# EAGLE design water system (EAGLE 9.7.0)
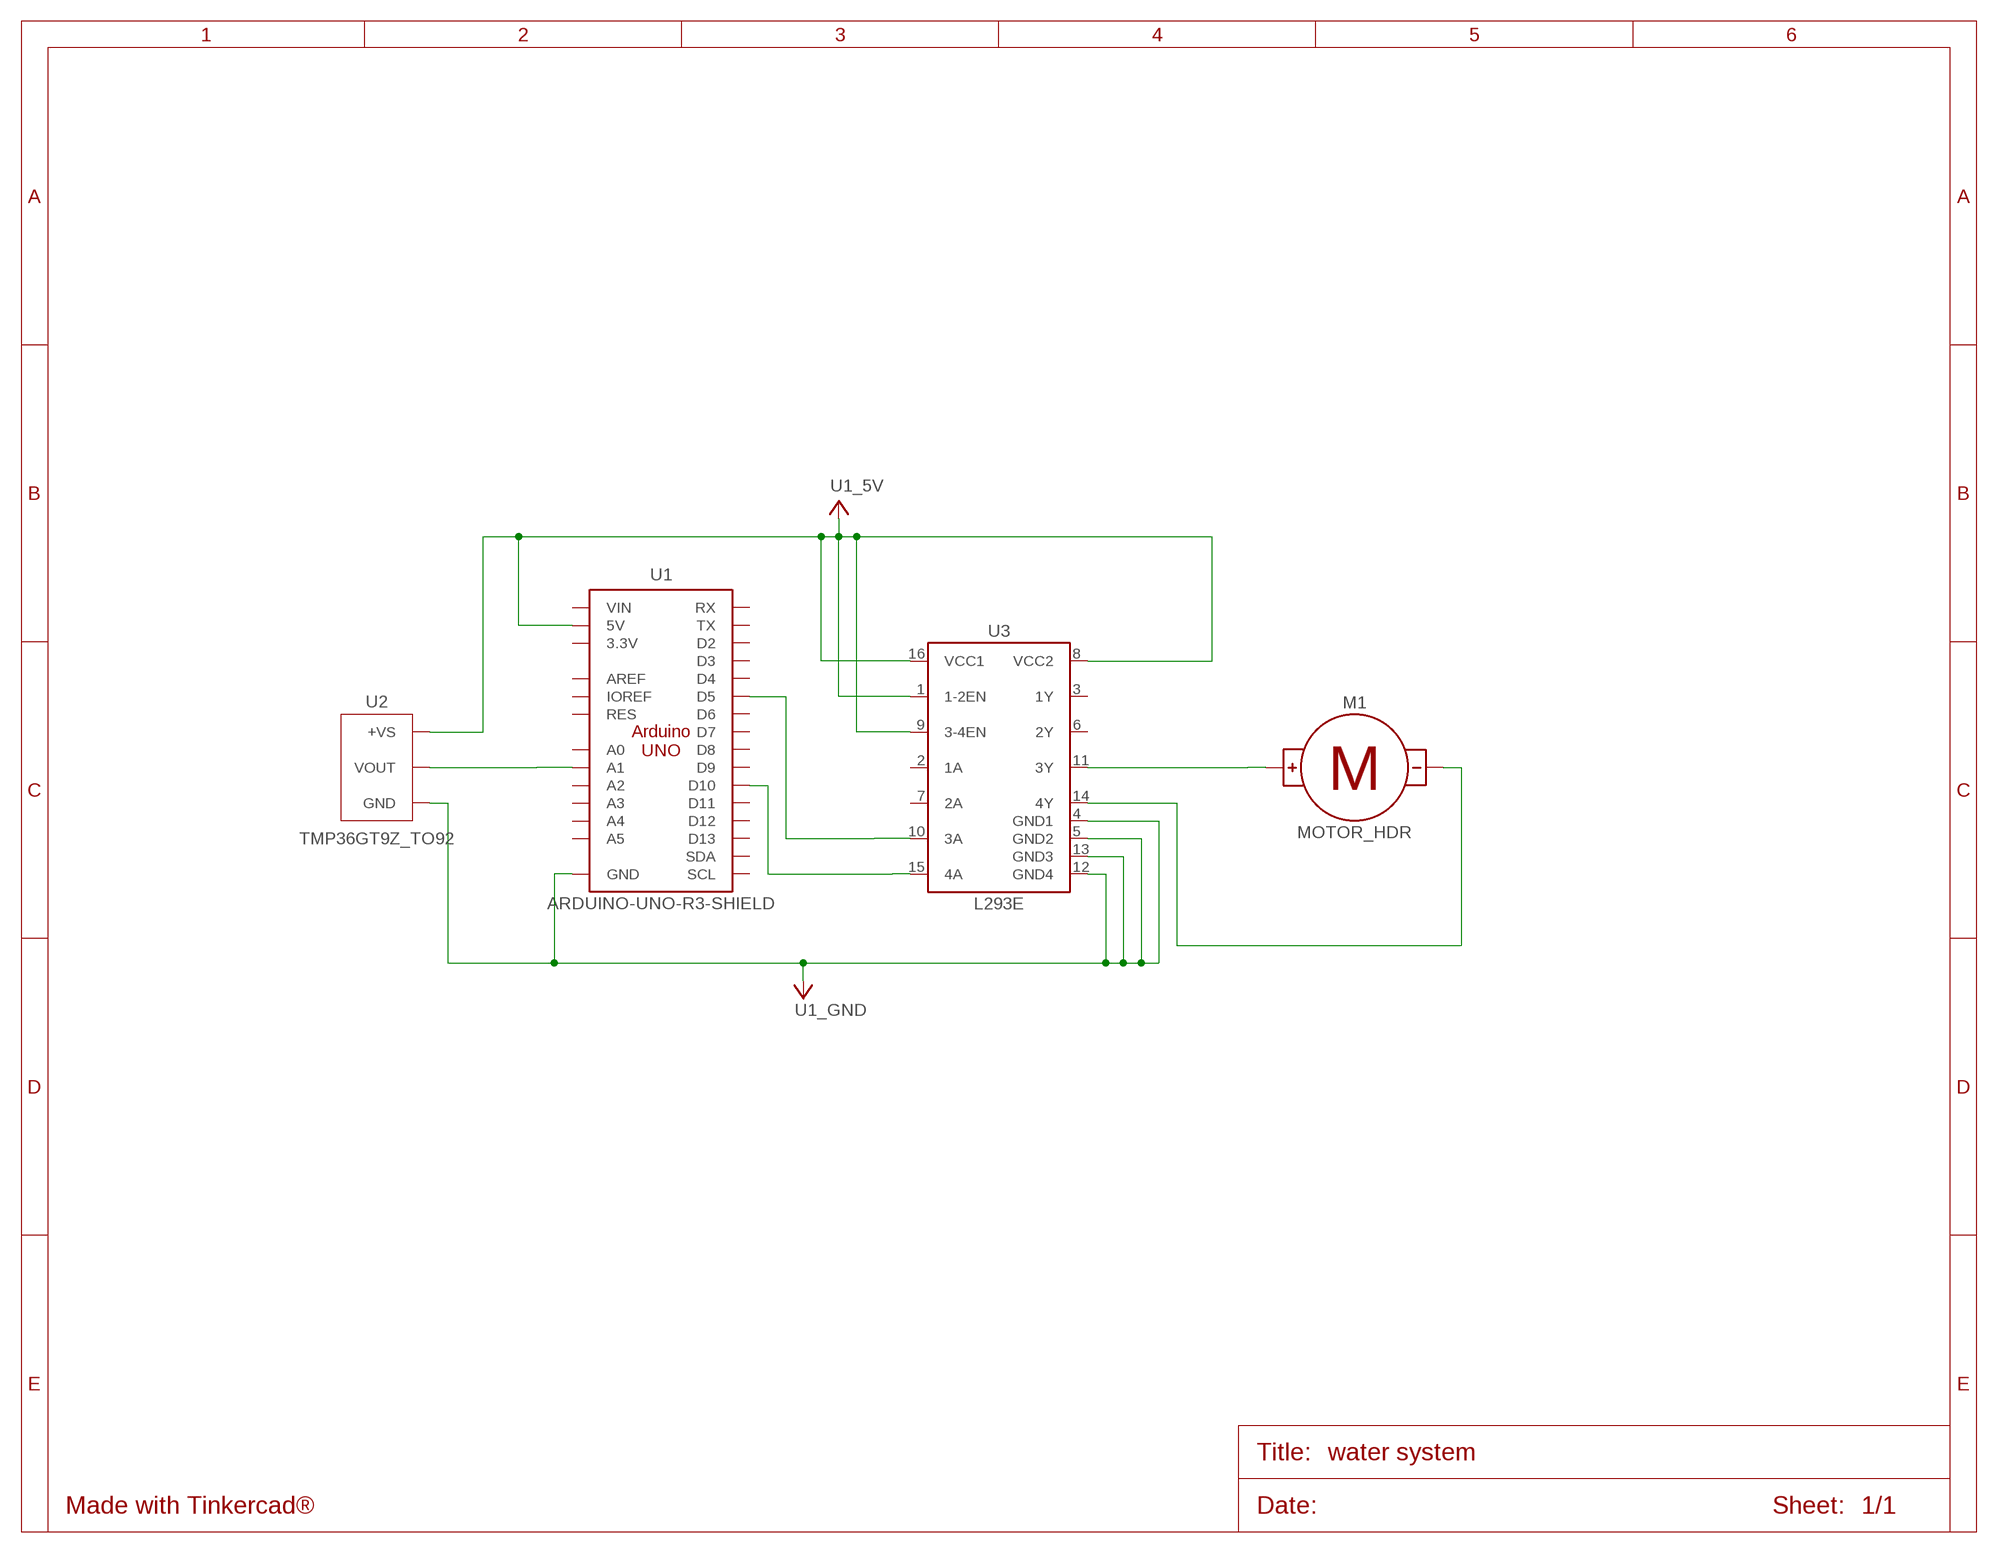
[diagram p0: schematic, sheet 1]

## Parts
M1  MOTOR_HDR  [MOTOR]
U1  ARDUINO-UNO-R3-SHIELD  [ARDUINO-UNO-R3-SHIELD]
U2  TMP36GT9Z_TO92  [TO92]
U3  L293E  [DIP762W53P254L1969H508Q16B]

## Nets
M1_+: M1.+ U3.11(3Y)
M1_-: M1.- U3.14(4Y)
U1_5V: U1.5V U2.3(+VS) U3.1(1-2EN) U3.8(VCC2) U3.9(3-4EN) U3.16(VCC1)
U1_A1: U1.A1 U2.2(VOUT)
U1_D5: U1.D5 U3.10(3A)
U1_D10: U1.D10 U3.15(4A)
U1_GND: U1.GND@0(GND) U1.GND@1(GND) U1.GND@2(GND) U2.1(GND) U3.4(GND1) U3.5(GND2) U3.12(GND4) U3.13(GND3)
Unconnected: U1.3.3V U1.A0 U1.A2 U1.A3 U1.A4 U1.A5 U1.AREF U1.D2 U1.D3 U1.D4 U1.D6 U1.D7 U1.D8 U1.D9 U1.D11 U1.D12 U1.D13 U1.IOREF U1.RES U1.RX U1.SCL U1.SDA U1.TX U1.VIN U3.2(1A) U3.3(1Y) U3.6(2Y) U3.7(2A)

## Library data of the parts
M1 = Tinkercad:MOTOR
U1 = Tinkercad:ARDUINO-UNO-R3-SHIELD
U2 = Tinkercad:TMP36GT9Z: SENSOR ANALOG -40C-125C
U3 = Tinkercad:L293E: L293D H-bridge motor driver Datasheet <https://www.ti.com/lit/ds/symlink/l293.pdf>

## Board
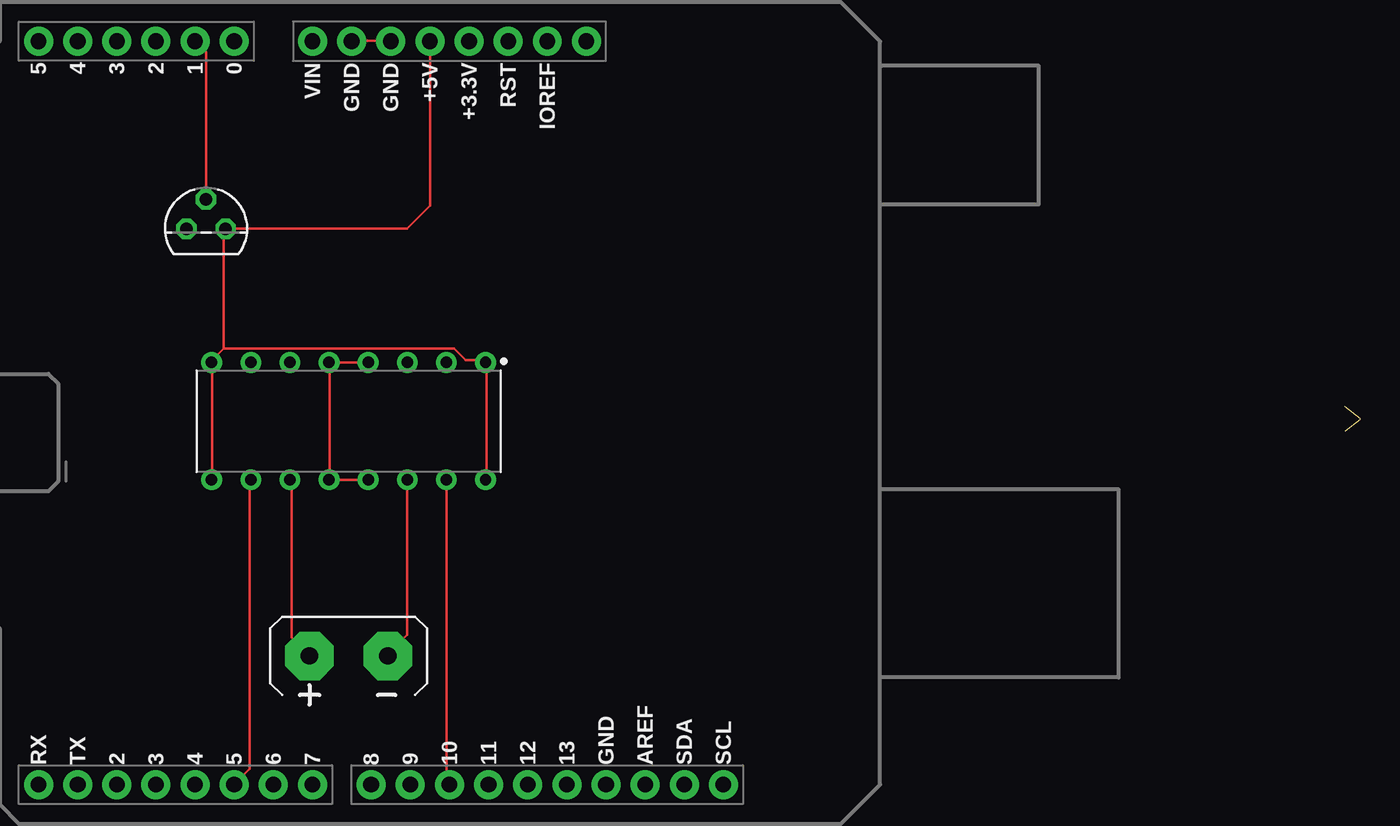
[diagram p1: board, top side]
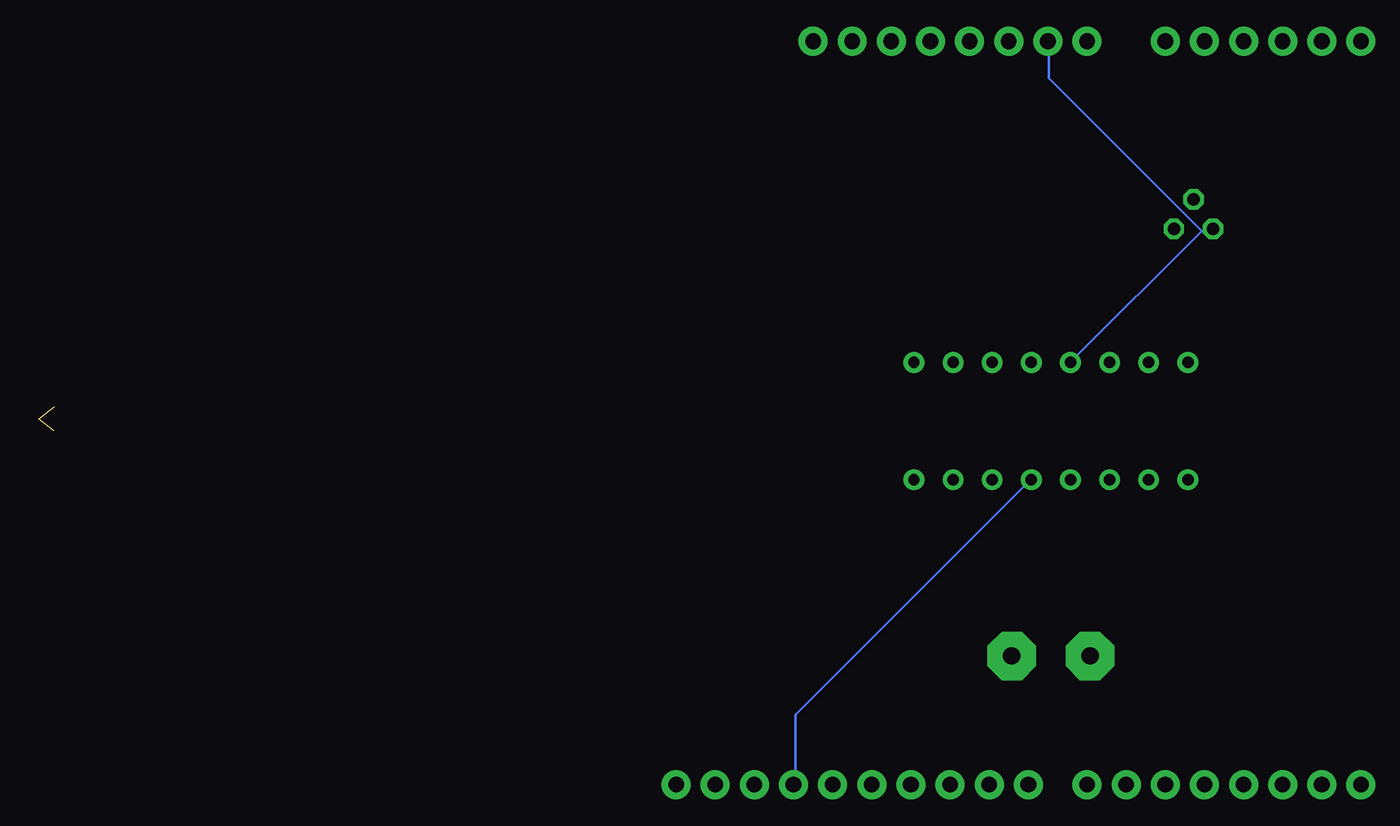
[diagram p2: board, bottom side, seen from below]

Size 1.04 x 1.6 mm. Coordinates in mm from the lower left corner, seen from the top.
Outline: 0.01,0 1.04,0.8 0,1.6
Copper layers (1*16): Top 0.035mm / dielectric 1.5mm / Bottom 0.035mm
Design rules "default": minimum track width 6mil, minimum drill 0.35mm, track to track 6mil, track to pad 6mil, pad to pad 6mil, via to via 6mil, smd to smd 6mil, copper to edge 40mil, drill to drill 6mil, minimum pad ring 10mil, minimum via ring 8mil, stop-mask expansion 4mil, vias tented up to drill 0mil, thermal gap 10mil

### Footprints (pad centres in the part's own frame; a part is rotated, then mirrored left to right if it is on the bottom)
MOTOR = drill 1.118 pad 3.15 octagon: + 2.54,0; - -2.54,0
ARDUINO-UNO-R3-SHIELD = drill 1.016 pad 1.88: 3.3V 24.13,-2.54; 5V 24.13,0; A0 24.13,12.7; A1 24.13,15.24; A2 24.13,17.78; A3 24.13,20.32; A4 24.13,22.86; A5 24.13,25.4; AREF -24.13,-13.97; D2 -24.13,20.32; D3 -24.13,17.78; D4 -24.13,15.24; D5 -24.13,12.7; D6 -24.13,10.16; D7 -24.13,7.62; D8 -24.13,3.81; D9 -24.13,1.27; D10 -24.13,-1.27; D11 -24.13,-3.81; D12 -24.13,-6.35; D13 -24.13,-8.89; GND@0 24.13,2.54; GND@1 24.13,5.08; GND@2 -24.13,-11.43; IOREF 24.13,-7.62; NC 24.13,-10.16; RES 24.13,-5.08; RX -24.13,25.4; SCL -24.13,-19.05; SDA -24.13,-16.51; TX -24.13,22.86; VIN 24.13,7.62
TO92 = drill 0.813 octagon: 1 -1.27,0; 2 0,1.905; 3 1.27,0
DIP762W53P254L1969H508Q16B = drill 0.743 pad 1.343: 1 -3.81,8.89; 2 -3.81,6.35; 3 -3.81,3.81; 4 -3.81,1.27; 5 -3.81,-1.27; 6 -3.81,-3.81; 7 -3.81,-6.35; 8 -3.81,-8.89; 9 3.81,-8.89; 10 3.81,-6.35; 11 3.81,-3.81; 12 3.81,-1.27; 13 3.81,1.27; 14 3.81,3.81; 15 3.81,6.35; 16 3.81,8.89

### Placement (x,y rotation side)
M1  -64.66,-14.59 180 top  (outside the outline)
U1  -59.39,1.18 90 top  (outside the outline)
U2  -73.91,13.14 0 top  (outside the outline)
U3  -64.66,0.65 270 top  (outside the outline)

### Tracks (layer width: path | path; a pad name or v marks a point on that pad's centre or on a via)
M1_+
  Top 0.152: U3.11 -68.35,-3.16 -68.35,-13.37 -67.28,-14.44 M1.+
M1_-
  Top 0.152: U3.14 -60.88,-3.16 -60.88,-13.22 -62.1,-14.44 M1.-
U1_5V
  Top 0.152: U3.16 -55.7,-3.01 -55.7,4.46 U3.1 -55.85,4.61 -57.07,4.61 -57.83,5.37 -72.77,5.37 | -72.77,5.37 -72.77,12.99 U2.3 -72.61,13.14 -60.88,13.14 -59.39,14.64 U1.5V | -72.77,5.37 -73.53,4.61 U3.8 -73.53,4.46 -73.53,-3.01 U3.9
U1_A1
  Top 0.152: U2.2 -73.91,24.59 U1.A1
U1_D5
  Top 0.152: U3.10 -71.09,-3.16 -71.09,-21.91 -72,-22.82 U1.D5
U1_D10
  Top 0.152: U3.15 -58.29,-3.16 -58.29,-22.67 -58.14,-22.82 U1.D10
U1_GND
  Top 0.152: U1.GND@1 -64.38,25.33 -61.95,25.33 U1.GND@0 | U3.13 -63.47,-3.16 -65.91,-3.16 U3.12 -65.91,-3.01 -65.91,4.46 | -65.91,4.46 -63.47,4.46 U3.4 | -65.91,4.46 U3.5
  Bottom 0.152: -74.44,12.99 -75.05,12.99 U2.1 | -74.44,12.99 -66.06,4.61 U3.5 | U1.GND@2 -48.08,-22.82 -48.08,-18.4 -63.32,-3.16 U3.13 | -74.44,12.99 -64.54,22.9 -64.54,25.18 U1.GND@1